# EAGLE design atmega32u4-breakout-v1 (EAGLE 5.10)
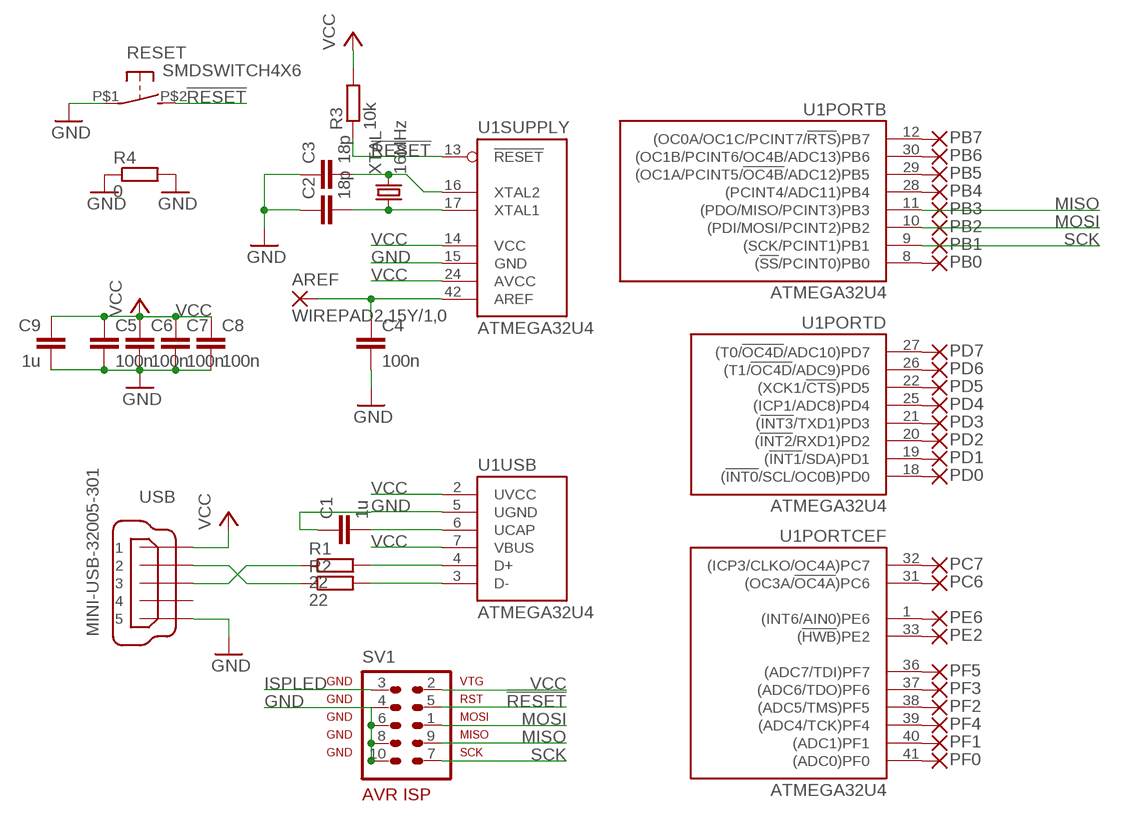
[diagram p0: schematic, sheet 1]

## Parts
AREF  WIREPAD2,15Y/1,0  [2,15Y/1,0]
C1  1u  C-EUC0603  [C0603]
C2  18p  C-EUC0603  [C0603]
C3  18p  C-EUC0603  [C0603]
C4  100n  C-EUC0603  [C0603]
C5  100n  C-EUC0603  [C0603]
C6  100n  C-EUC0603  [C0603]
C7  100n  C-EUC0603  [C0603]
C8  100n  C-EUC0603  [C0603]
C9  1u  C-EUC0603K  [C0603K]
PB0  WIREPAD2,15Y/1,0  [2,15Y/1,0]
PB1  WIREPAD2,15Y/1,0  [2,15Y/1,0]
PB2  WIREPAD2,15Y/1,0  [2,15Y/1,0]
PB3  WIREPAD2,15Y/1,0  [2,15Y/1,0]
PB4  WIREPAD2,15Y/1,0  [2,15Y/1,0]
PB5  WIREPAD2,15Y/1,0  [2,15Y/1,0]
PB6  WIREPAD2,15Y/1,0  [2,15Y/1,0]
PB7  WIREPAD2,15Y/1,0  [2,15Y/1,0]
PC6  WIREPAD2,15Y/1,0  [2,15Y/1,0]
PC7  WIREPAD2,15Y/1,0  [2,15Y/1,0]
PD0  WIREPAD2,15Y/1,0  [2,15Y/1,0]
PD1  WIREPAD2,15Y/1,0  [2,15Y/1,0]
PD2  WIREPAD2,15Y/1,0  [2,15Y/1,0]
PD3  WIREPAD2,15Y/1,0  [2,15Y/1,0]
PD4  WIREPAD2,15Y/1,0  [2,15Y/1,0]
PD5  WIREPAD2,15Y/1,0  [2,15Y/1,0]
PD6  WIREPAD2,15Y/1,0  [2,15Y/1,0]
PD7  WIREPAD2,15Y/1,0  [2,15Y/1,0]
PE2  WIREPAD2,15Y/1,0  [2,15Y/1,0]
PE6  WIREPAD2,15Y/1,0  [2,15Y/1,0]
PF0  WIREPAD2,15Y/1,0  [2,15Y/1,0]
PF1  WIREPAD2,15Y/1,0  [2,15Y/1,0]
PF2  WIREPAD2,15Y/1,0  [2,15Y/1,0]
PF3  WIREPAD2,15Y/1,0  [2,15Y/1,0]
PF4  WIREPAD2,15Y/1,0  [2,15Y/1,0]
PF5  WIREPAD2,15Y/1,0  [2,15Y/1,0]
R1  22  R-EU_R0603  [R0603]
R2  22  R-EU_R0603  [R0603]
R3  10k  R-EU_R0603  [R0603]
R4  0  R-EU_R0603  [R0603]
RESET  SMDSWITCH4X6  [SWSMD4X6]
SV1  AVR-ISP-10SMD  [2X5SMD]
U1  ATMEGA32U4  ATMEGAXU4  [TQFP44]
USB  MINI-USB-32005-301  [32005-301]
XTAL  16MHz  CRYSTALCS10  [CS10]

## Nets
!RESET: R3.1 RESET.P$2(S) SV1.5 U1.13(SUPPLY:!RESET)
AREF: AREF.1(P) C4.1 U1.42(SUPPLY:AREF)
GND: C1.1 C2.1 C3.1 C4.2 C5.2 C6.2 C7.2 C8.2 C9.2 R4.1 R4.2 RESET.P$1(P) SV1.4 SV1.6 SV1.8 SV1.10 U1.5(USB:UGND) U1.15(SUPPLY:GND) USB.5
ISPLED: SV1.3
MISO: PB3.1(P) SV1.9 U1.11(PORTB:(PDO/MISO/PCINT3)PB3)
MOSI: PB2.1(P) SV1.1 U1.10(PORTB:(PDI/MOSI/PCINT2)PB2)
N$1: R1.1 USB.3
N$2: R2.1 USB.2
N$3: PB0.1(P) U1.8(PORTB:(!SS!/PCINT0)PB0)
N$5: C2.2 U1.17(SUPPLY:XTAL1) XTAL.P$1
N$6: C3.2 U1.16(SUPPLY:XTAL2) XTAL.P$2
N$7: C1.2 U1.6(USB:UCAP)
N$9: R1.2 U1.4(USB:D+)
N$10: R2.2 U1.3(USB:D-)
N$13: PB4.1(P) U1.28(PORTB:(PCINT4/ADC11)PB4)
N$14: PB5.1(P) U1.29(PORTB:(OC1A/PCINT5/!OC4B!/ADC12)PB5)
N$15: PF0.1(P) U1.41(PORTCEF:(ADC0)PF0)
N$16: PF1.1(P) U1.40(PORTCEF:(ADC1)PF1)
N$17: PF4.1(P) U1.39(PORTCEF:(ADC4/TCK)PF4)
N$18: PF2.1(P) U1.38(PORTCEF:(ADC5/TMS)PF5)
N$19: PF3.1(P) U1.37(PORTCEF:(ADC6/TDO)PF6)
N$20: PF5.1(P) U1.36(PORTCEF:(ADC7/TDI)PF7)
N$21: PE2.1(P) U1.33(PORTCEF:(!HWB!)PE2)
N$22: PE6.1(P) U1.1(PORTCEF:(INT6/AIN0)PE6)
N$23: PC6.1(P) U1.31(PORTCEF:(OC3A/!OC4A!)PC6)
N$24: PC7.1(P) U1.32(PORTCEF:(ICP3/CLKO/OC4A)PC7)
N$25: PB6.1(P) U1.30(PORTB:(OC1B/PCINT6/OC4B/ADC13)PB6)
N$26: PB7.1(P) U1.12(PORTB:(OC0A/OC1C/PCINT7/!RTS!)PB7)
N$27: PD0.1(P) U1.18(PORTD:(!INT0!/SCL/OC0B)PD0)
N$28: PD1.1(P) U1.19(PORTD:(!INT1!/SDA)PD1)
N$29: PD2.1(P) U1.20(PORTD:(!INT2!/RXD1)PD2)
N$30: PD3.1(P) U1.21(PORTD:(!INT3!/TXD1)PD3)
N$31: PD4.1(P) U1.25(PORTD:(ICP1/ADC8)PD4)
N$32: PD5.1(P) U1.22(PORTD:(XCK1/!CTS!)PD5)
N$33: PD6.1(P) U1.26(PORTD:(T1/!OC4D!/ADC9)PD6)
N$34: PD7.1(P) U1.27(PORTD:(T0/!OC4D!/ADC10)PD7)
SCK: PB1.1(P) SV1.7 U1.9(PORTB:(SCK/PCINT1)PB1)
VCC: C5.1 C6.1 C7.1 C8.1 C9.1 R3.2 SV1.2 U1.2(USB:UVCC) U1.7(USB:VBUS) U1.14(SUPPLY:VCC) U1.24(SUPPLY:AVCC) USB.1
Unconnected: USB.4

## Power pins joined to a net without a drawn wire
GND: U1.23(GND) U1.35(GND) U1.43(GND)
VCC: U1.34(VCC) U1.44(AVCC)

## Library data of the parts
AREF PB0 PB1-PB7 PC6 PC7 PD0 PD1-PD7 PE2 PE6 PF0 PF1-PF5 = jocki:WIREPAD: Wire PAD connect wire on PCB
C1-C9 = rcl:C-EU: CAPACITOR, European symbol
R1-R4 = rcl:R-EU_: RESISTOR, European symbol
RESET = jocki:SMDSWITCH
SV1 = atmel-1:AVR-ISP-10: AVR ISP-10 Serial Programming Header
U1 = jocki:ATMEGAXU4: Atmel Atmega16U4 or Atmega32U4
USB = jocki:MINI-USB-: MINI USB-B Conector Source: www.cypressindustries.com
XTAL = jocki:CRYSTAL

## Board
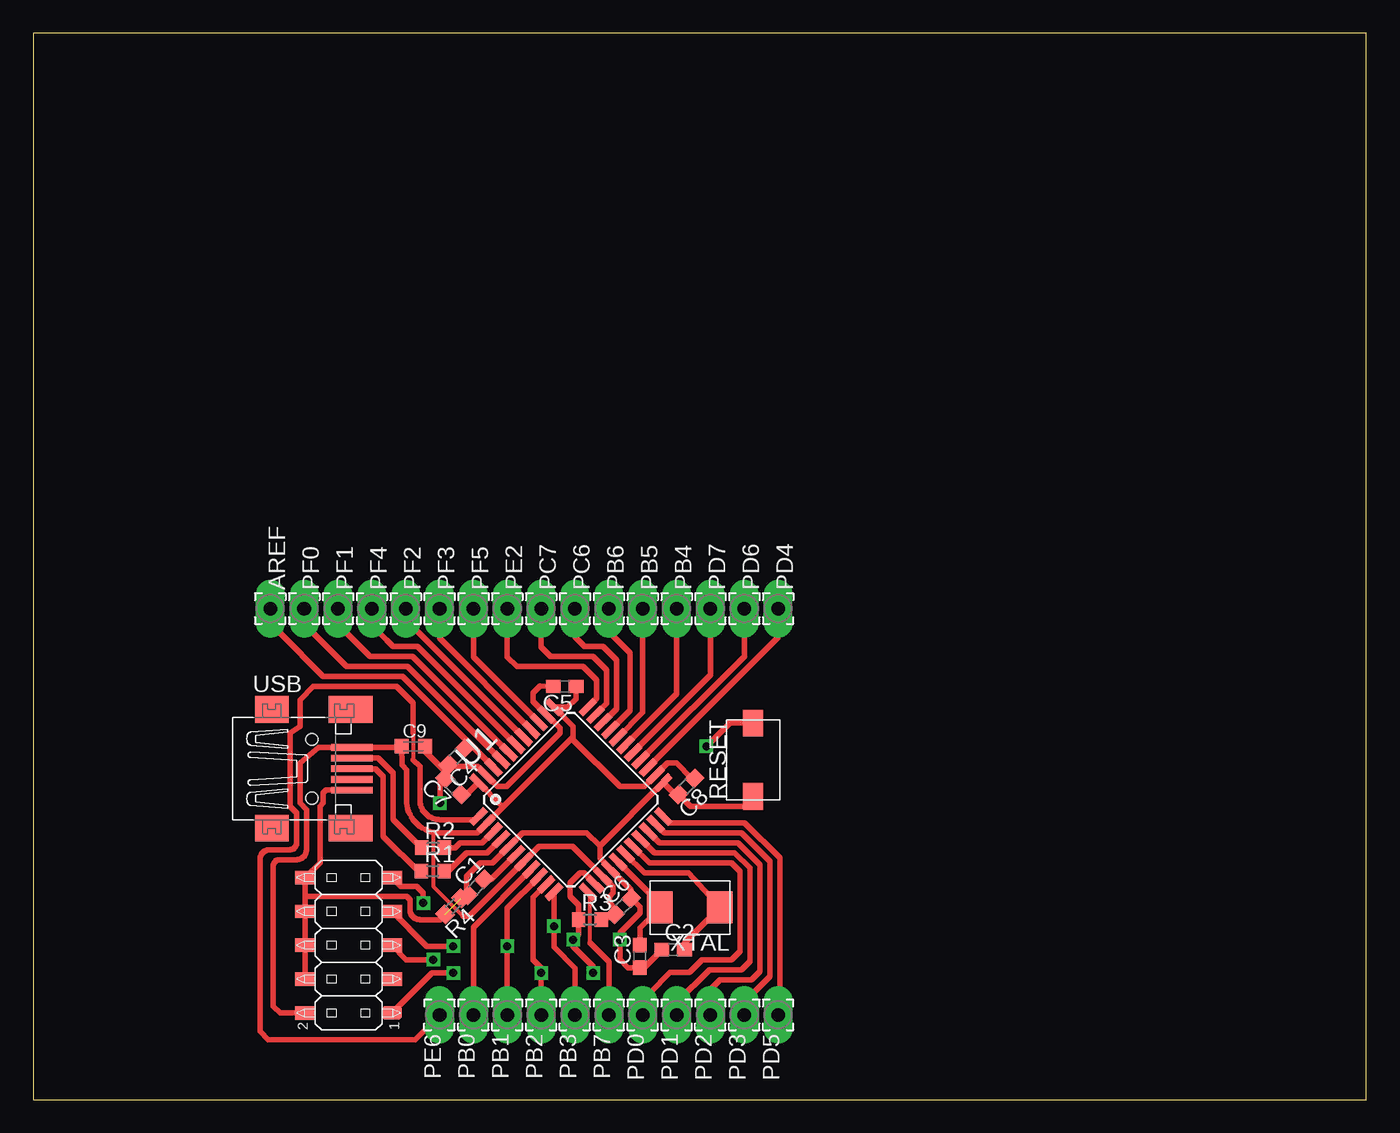
[diagram p1: board, top side]
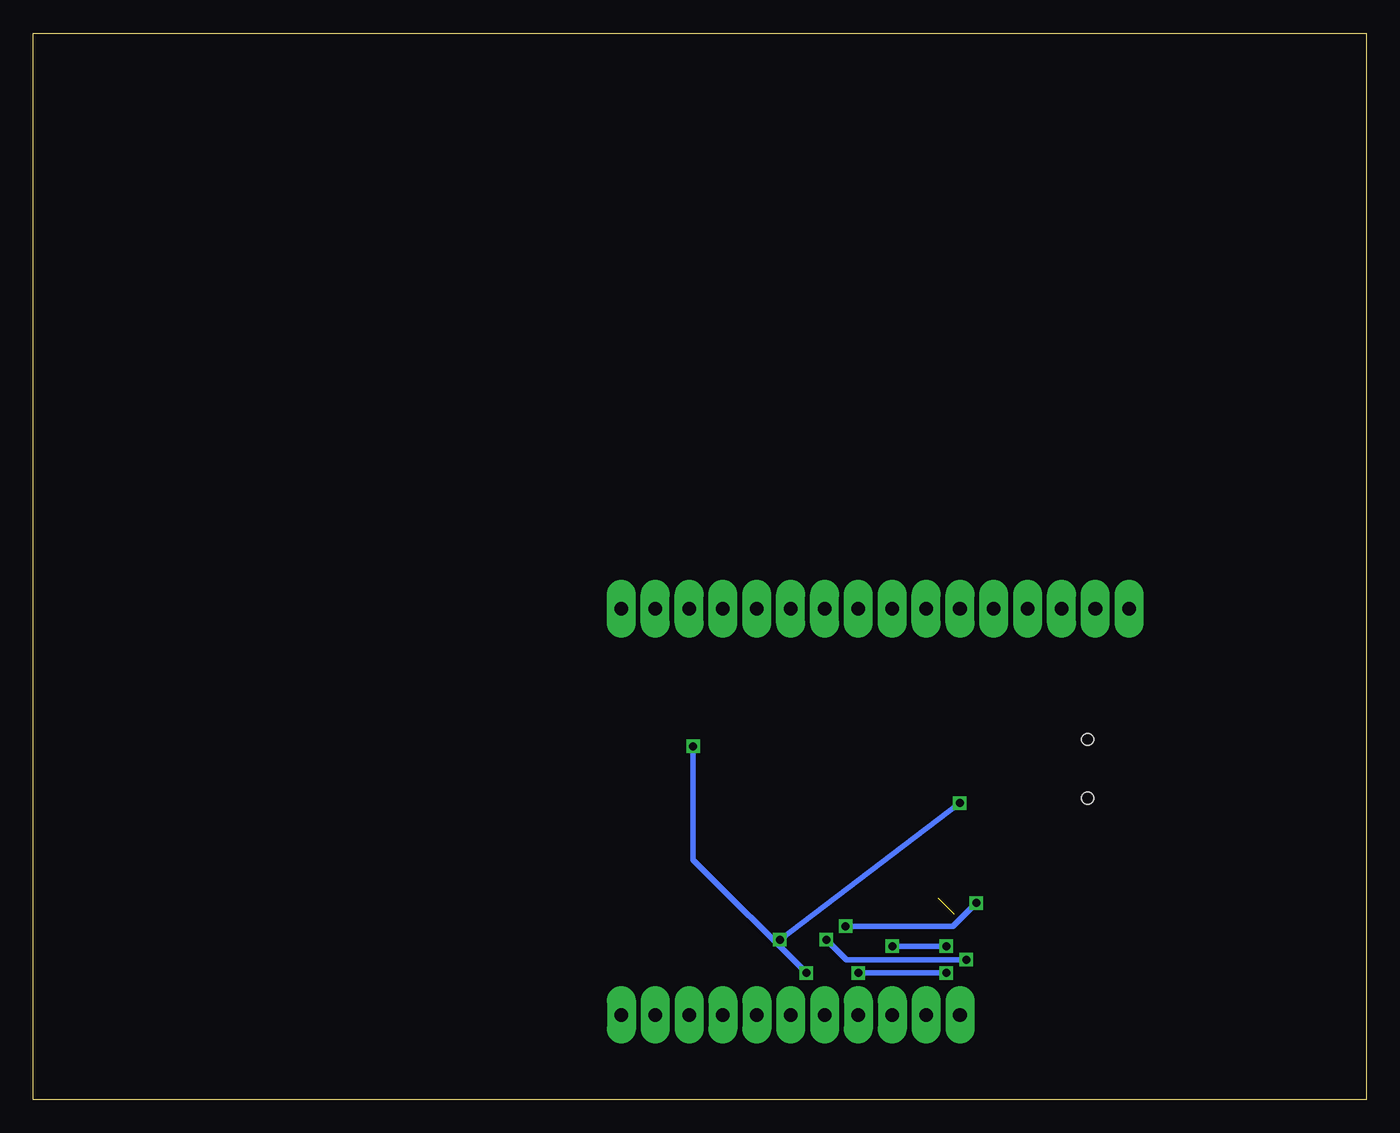
[diagram p2: board, bottom side, seen from below]

Size 100 x 80 mm. Coordinates in mm from the lower left corner, seen from the top.
Outline: 0,0 100,0 100,80 0,80 0,0
Copper layers (1*16): Top 0.035mm / dielectric 1.5mm / Bottom 0.035mm
Design rules "default": minimum track width 10mil, minimum drill 24mil, track to track 8mil, track to pad 8mil, pad to pad 8mil, via to via 8mil, smd to smd 8mil, copper to edge 40mil, drill to drill 8mil, minimum pad ring 10mil, minimum via ring 8mil, stop-mask expansion 4mil, vias tented up to drill 0mil, thermal gap 10mil

### Footprints (pad centres in the part's own frame; a part is rotated, then mirrored left to right if it is on the bottom)
2,15Y/1,0 = drill 1.016 pad 2.159 long: 1 0,0
C0603 = smd 1.1 x 1: 1 -0.85,0; 2 0.85,0
C0603K = smd 1.05 x 1.08: 1 -0.875,0; 2 0.875,0
R0603 = smd 1 x 1.1: 1 -0.85,0; 2 0.85,0
SWSMD4X6 = smd 2 x 1.5: P$1 -2.75,0; P$2 2.75,0
2X5SMD = smd 1 x 1.5: 1 -5.08,-3.25; 2 -5.08,3.25; 3 -2.54,-3.25; 4 -2.54,3.25; 5 0,-3.25; 6 0,3.25; 7 2.54,-3.25; 8 2.54,3.25; 9 5.08,-3.25; 10 5.08,3.25
TQFP44 = smd 1.5 x 0.5: 1 -5.8,4; 2 -5.8,3.2; 3 -5.8,2.4; 4 -5.8,1.6; 5 -5.8,0.8; 6 -5.8,0; 7 -5.8,-0.8; 8 -5.8,-1.6; 9 -5.8,-2.4; 10 -5.8,-3.2; 11 -5.8,-4; 23 5.8,-4; 24 5.8,-3.2; 25 5.8,-2.4; 26 5.8,-1.6; 27 5.8,-0.8; 28 5.8,0; 29 5.8,0.8; 30 5.8,1.6; 31 5.8,2.4; 32 5.8,3.2; 33 5.8,4 | smd 0.5 x 1.5: 12 -4,-5.8; 13 -3.2,-5.8; 14 -2.4,-5.8; 15 -1.6,-5.8; 16 -0.8,-5.8; 17 0,-5.8; 18 0.8,-5.8; 19 1.6,-5.8; 20 2.4,-5.8; 21 3.2,-5.8; 22 4,-5.8; 34 4,5.8; 35 3.2,5.8; 36 2.4,5.8; 37 1.6,5.8; 38 0.8,5.8; 39 0,5.8; 40 -0.8,5.8; 41 -1.6,5.8; 42 -2.4,5.8; 43 -3.2,5.8; 44 -4,5.8
32005-301 = smd 3.1 x 0.5: 1 3,1.6; 2 3,0.8; 3 3,0; 4 3,-0.8; 5 3,-1.6 | smd 2.5 x 2: M1 -3,-4.45; M2 -3,4.45 | smd 3.3 x 2: M3 2.9,4.45; M4 2.9,-4.45 | drill 0.127 pad 0.508 round: P$1 0,2.21; P$2 0,-2.21 | hole 0.9: 0,2.2; 0,-2.2
CS10 = smd 1.9 x 2.4: P$1 -2.25,0; P$2 2.25,0

### Placement (x,y rotation side)
AREF  17.78,36.83 90 top
C1  33.21,15.91 45 top
C2  48,11.25 0 top
C3  45.5,10.75 90 top
C4  31.75,25.75 225 top
C5  39.87,31 180 top
C6  44.25,14.5 45 top
C7  31.5,23.5 135 top
C8  49,23.5 225 top
C9  28.5,26.5 0 top
PB0  33.02,6.35 270 top
PB1  35.56,6.35 270 top
PB2  38.1,6.35 270 top
PB3  40.64,6.35 270 top
PB4  48.26,36.83 90 top
PB5  45.72,36.83 90 top
PB6  43.18,36.83 90 top
PB7  43.18,6.35 270 top
PC6  40.64,36.83 90 top
PC7  38.1,36.83 90 top
PD0  45.72,6.35 270 top
PD1  48.26,6.35 270 top
PD2  50.8,6.35 270 top
PD3  53.34,6.35 270 top
PD4  55.88,36.83 90 top
PD5  55.88,6.35 270 top
PD6  53.34,36.83 90 top
PD7  50.8,36.83 90 top
PE2  35.56,36.83 90 top
PE6  30.48,6.35 270 top
PF0  20.32,36.83 90 top
PF1  22.86,36.83 90 top
PF2  27.94,36.83 90 top
PF3  30.48,36.83 90 top
PF4  25.4,36.83 90 top
PF5  33.02,36.83 90 top
R1  29.97,17.14 0 top
R2  29.99,18.89 0 top
R3  41.75,13.5 0 top
R4  31.5,14.5 225 top
RESET  54,25.5 90 top
SV1  23.65,11.58 90 top
U1  40.33,22.51 45 top
USB  20.89,24.82 0 top
XTAL  49.26,14.41 180 top

### Tracks (layer width: path | path; a pad name or v marks a point on that pad's centre or on a via)
!RESET  (via drill 0.6)
  Top 0.406: U1.13 41.31,17 41,17 40.25,16.25 40.25,15.25 40.9,14.6 R3.1 40.9,12.4 v40.5,12 40.5,11.5 42,10 v42,9.5 | SV1.5 27.98,10.5 v30,10.5 | v50.5,26.5 52.25,28.25 RESET.P$2
  Bottom 0.406: v30,10.5 39,10.5 v40.5,12 | v50.5,26.5 50.5,18 v42,9.5
AREF
  Top 0.406: AREF.1 17.78,35.63 18.41,35 18.5,35 21.75,31.75 27,31.75 | 27,31.75 27.5,31.75 | 32.72,26.72 27.7,31.75 27,31.75 | 32.72,26.72 U1.42 | 32.72,26.72 C4.1
GND  (via drill 0.6)  (1 unrouted)
  Top 0.406: 42.5,19.02 42.5,18.08 U1.15 44.85,15.73 C6.2 45.5,14.45 45.5,14 44,12.5 v44,12 44,10.54 44.63,9.9 C3.1 45.8,9.9 C2.1 | 42.5,19.02 U1.23 48.14,22.9 C8.2 49.3,22 53.5,22 54,22.5 RESET.P$1 | 42.5,19.02 41.52,20 36.69,20 U1.5 34.44,17.75 33.5,17.75 32.5,16.75 32.5,15.42 arc90 C1.1 R4.1 | C5.2 38.01,31.01 37.5,30.5 37.5,29.86 U1.35 39.5,27.86 39.5,27.5 35.5,23.5 34.81,23.5 U1.43 33.31,25 31.5,25 | 31.5,25 31.4,25.1 C4.2 | 30.9,24.4 31,24.5 | 31,24.5 31.5,25 | 30.9,24.4 C7.2 31,24.2 31,24.5 | 30.9,24.4 30.5,24 v30.5,22.25 | USB.5 21.97,23.22 21.75,23 21.75,22.25 21.5,22 21.5,17.76 SV1.10 20.4,15.25 | 20.4,15.25 SV1.8 SV1.6 SV1.4 | C9.2 29.35,26.15 31,24.5 | 20.4,15.25 28,15.25 28.25,15 28.25,14.25 arc90 29,13.5 30.5,13.5 R4.2
  Bottom 0.406: v44,12 v30.5,22.25
MISO  (via drill 0.6)
  Top 0.406: U1.11 v39.06,13 39.06,11.44 40.64,9.86 PB3.1 | SV1.9 27.56,16 28.75,16 29.25,15.5 v29.25,14.75
  Bottom 0.406: v29.25,14.75 31,13 v39.06,13
MOSI  (via drill 0.6)
  Top 0.406: U1.10 37.5,15.15 37.5,10.5 38.1,9.9 v38.1,9.5 PB2.1 | SV1.1 29.9,9.5 v31.5,9.5
  Bottom 0.406: v31.5,9.5 v38.1,9.5
N$1
  Top 0.406: R1.1 29,17 26.25,19.76 26.25,23.5 26.25,24.25 25.68,24.82 USB.3
N$2
  Top 0.406: R2.1 27,21.03 27,24.5 25.88,25.62 USB.2
N$3
  Top 0.406: U1.8 33.02,12.94 PB0.1
N$5
  Top 0.406: U1.17 45.84,17 48.5,17 49.17,17 XTAL.P$1 48.85,11.75 C2.2
N$6
  Top 0.406: U1.16 46.55,15.16 XTAL.P$2 | XTAL.P$2 47.6,14.57 | C3.2 45.5,12.9 XTAL.P$2
N$7
  Top 0.406: U1.6 34.33,16.51 C1.2
N$9
  Top 0.406: U1.4 34.06,18.5 32.5,18.5 31.14,17.14 R1.2
N$10
  Top 0.406: U1.3 33.68,19.25 32,19.25 31.64,18.89 R2.2
N$13
  Top 0.406: U1.28 48.26,30.44 PB4.1
N$14
  Top 0.406: U1.29 45.72,29.03 PB5.1
N$15
  Top 0.406: U1.41 28.08,32.5 26,32.5 23.5,32.5 21,35 20.32,35.68 PF0.1
N$16
  Top 0.406: U1.40 28.46,33.25 26.5,33.25 25.25,33.25 23.5,35 22.86,35.64 PF1.1
N$17
  Top 0.406: U1.39 28.84,34 28,34 27,34 26.5,34.5 25.4,35.6 PF4.1
N$18
  Top 0.406: U1.38 27.94,36.03 PF2.1
N$19
  Top 0.406: U1.37 30.48,34.62 PF3.1
N$20
  Top 0.406: U1.36 33.02,33.21 PF5.1
N$21
  Top 0.406: U1.33 42.25,30.09 42.25,31.5 41.25,32.5 38,32.5 36.27,32.5 35.56,33.22 PE2.1
N$22
  Top 0.305: 28.5,27.5 28.5,25.5
  Top 0.406: U1.1 33.16,21 30.5,21 arc-90 29,22.5 29,25 28.5,25.5 | 28.5,27.5 28.5,29.75 27.25,31 21,31 20,30 20,28 19.25,27.5 19.25,22 19.75,21.5 19.75,19.25 arc-90 19.25,18.75 17.75,18.75 arc90 17,18 17,5.13 17.64,4.5 28.63,4.5 PE6.1
N$23
  Top 0.406: U1.31 43.75,29.32 43.75,33 42.75,34 41.5,34 41.35,34 40.64,34.72 PC6.1
N$24
  Top 0.406: U1.32 43,29.71 43,32.25 42,33.25 39.5,33.25 38.81,33.25 38.1,33.97 PC7.1
N$25
  Top 0.406: U1.30 44.75,29.19 44.75,33.5 43.18,35.07 PB6.1
N$26
  Top 0.305: 41.75,11.75 41.75,15.43
  Top 0.406: 41.75,15.43 U1.12 | 41.75,11.75 43.18,10.32 PB7.1
N$27
  Top 0.406: U1.18 46.22,17.75 51.25,17.75 52.37,17.75 53,17.11 53,16.5 53,11.13 52.37,10.5 50.19,10.5 49.22,9.54 47.78,9.54 46.25,8 45.72,7.47 PD0.1
N$28
  Top 0.406: U1.19 46.6,18.5 51.5,18.5 52.62,18.5 53.75,17.36 53.75,16.5 53.75,10.38 53.12,9.75 50.73,9.75 48.26,7.29 PD1.1
N$29
  Top 0.406: U1.20 46.98,19.25 51.5,19.25 52.87,19.25 54.5,17.61 54.5,16.5 54.5,9.63 53.87,9 51.52,9 50.8,8.29 PD2.1
N$30
  Top 0.406: U1.21 47.37,20 47.5,20 51.5,20 53.12,20 55.25,17.86 55.25,16.5 55.25,9.25 53.34,7.34 PD3.1
N$31
  Top 0.406: U1.25 55.88,34.67 PD4.1
N$32
  Top 0.406: U1.22 47.5,21 47.75,20.75 51.25,20.75 53.37,20.75 56,18.11 56,7 56,6.47 PD5.1
N$33
  Top 0.406: U1.26 53.34,33.26 PD6.1
N$34
  Top 0.406: U1.27 50.8,31.85 PD7.1
SCK  (via drill 0.6)
  Top 0.406: U1.9 35.56,14.35 v35.56,11.5 PB1.1 | SV1.7 29.52,11.5 v31.5,11.5
  Bottom 0.406: v31.5,11.5 v35.56,11.5
VCC
  Top 0.305: 32.25,13.75 30,16 30,20
  Top 0.406: 35.15,21.85 U1.2 33.29,20 30.5,20 | 35.15,21.85 40.5,27.21 | 40.5,27.21 40.5,28 U1.34 40.09,29.44 40.72,30.07 C5.1 | 40.5,27.21 40.5,27 44,23.5 45.85,23.5 U1.24 47.6,25.25 48.25,25.25 49.4,24.1 C8.1 | 35.15,21.85 35.15,22.04 U1.44 32.52,22.9 C7.1 | 32.25,13.75 32.7,13.75 U1.7 37.95,19 40.45,19 U1.14 43.5,15.95 43.5,15.5 43.22,15.22 43.22,14.78 43.65,14.35 C6.1 42.75,13.5 R3.2 | SV1.2 18.5,6.5 18,7 18,17.5 arc-90 18.5,18 19.75,18 arc90 20.5,18.75 20.5,21.75 20,22.25 20,25.25 21.42,26.42 USB.1 27.57,26.42 C9.1 27.65,25.1 28,24.75 28,22.5 arc90 30.5,20 | 30.5,20 30,20

### Text on the board
Reference: REF | PF0 | PF1 | PF4 | PF2 | PF3 | PF5 | PE2 | PC7 | PC6 | PB6 | PB5 | PB4 | PD7 | PD6 | PD4 | RESET | ISP | PB | PD | 0 | 1 | 2 | 3 | 7 | 0 | 1 | 2 | 3 | 5 | 1 | PE6